# Altium schematic sheet MCU.SchDoc
size A4; SheetNumber: 2; SheetTotal: 5
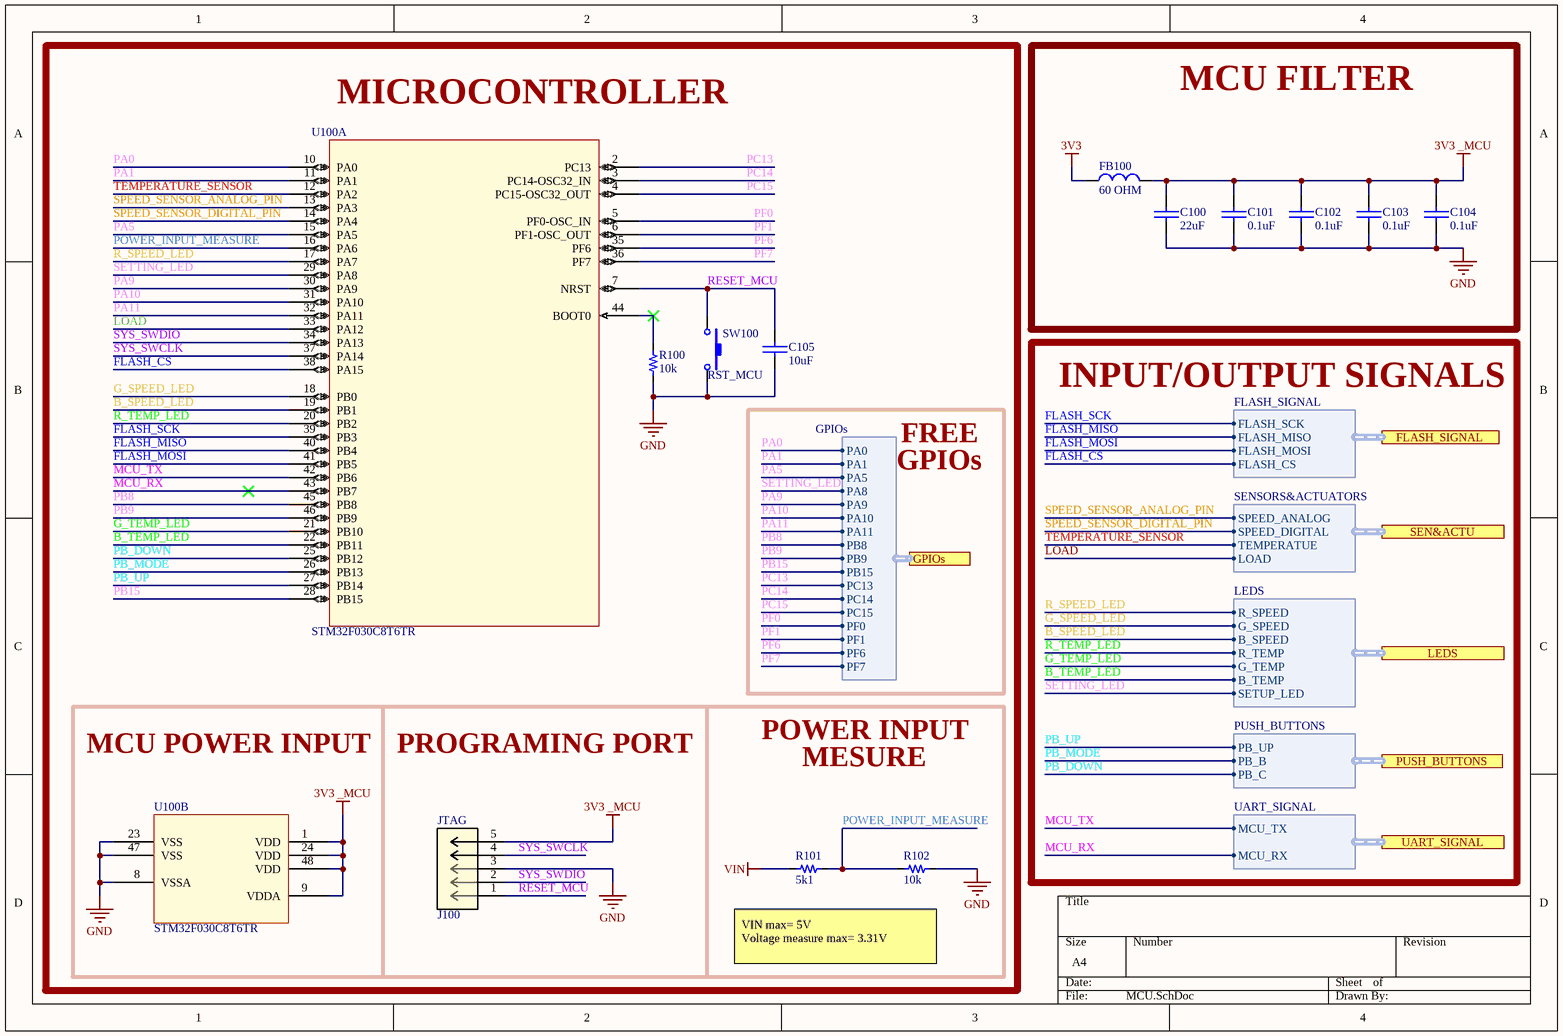
[diagram p0: MCU.SchDoc]

## Parts
C100  value 22uF  [0603_cap]  (hidden comment: 22uF 6V3)
C101  value 0.1uF  [0603_cap]  (hidden comment: 0.1uF 50V)
C102  value 0.1uF  [0603_cap]  (hidden comment: 0.1uF 50V)
C103  value 0.1uF  [0603_cap]  (hidden comment: 0.1uF 50V)
C104  value 0.1uF  [0603_cap]  (hidden comment: 0.1uF 50V)
C105  value 10uF  [0603_cap]  (hidden comment: 10uF 10V)
FB100  value 60 OHM  [0603_fb]  (hidden comment: 60OHM 2A)
J100  JTAG  [CON_5X1_TH_2.54MM]
R100  value 10k  [0603_res]  (hidden comment: 10k 1/10W)
R101  value 5k1  [0603_res]  (hidden comment: 5k1 1/10W)
R102  value 10k  [0603_res]  (hidden comment: 10k 1/10W)
SW100  RST_MCU  [Sw_PUSH_4.5x4.5x5mm]
U100  STM32F030C8T6TR  [LQFP48_7x7mm]  (parts A,B of 2)

## Blocks framed on the sheet
MICROCONTROLLER: C105 J100 R100-R102 SW100 U100
MCU FILTER: C100-C104 FB100

## Ports
FLASH_SIGNAL (harness FLASH_SIGNAL, see main[2B], Communication[4D]), GPIOs (harness GPIOs, see main[2C], Power[3C]), LEDS (harness LEDS, see main[2C], INPUTS_OUTPUTS[4B]), PUSH_BUTTONS (harness PUSH_BUTTONS, see main[2C], INPUTS_OUTPUTS[4B]), SEN&ACTU (harness SENSORS&ACTUATORS, see main[2C], INPUTS_OUTPUTS[4A]), UART_SIGNAL (harness UART_SIGNAL, see main[2B], Communication[4C])

## Harnesses
LEDS: R_SPEED, G_SPEED, B_SPEED, R_TEMP, G_TEMP, B_TEMP, SETUP_LED
SENSORS&ACTUATORS: SPEED_ANALOG, SPEED_DIGITAL, TEMPERATUE, LOAD
PUSH_BUTTONS: PB_UP, PB_B, PB_C
FLASH_SIGNAL: FLASH_SCK, FLASH_MISO, FLASH_MOSI, FLASH_CS
UART_SIGNAL: MCU_TX, MCU_RX
GPIOs: PA0, PA1, PA5, PA8, PA9, PA10, PA11, PB8, PB9, PB15, PC13, PC14, PC15, PF0, PF1, PF6, PF7

## Nets
3V3: FB100.2
3V3 _MCU: C100.1 C101.1 C102.1 C103.1 C104.1 FB100.1 J100.5 U100.1(VDD) U100.9(VDDA) U100.24(VDD) U100.48(VDD)
GND: C100.2 C101.2 C102.2 C103.2 C104.2 C105.2 J100.3 R100.2 R102.1 SW100.2 U100.8(VSSA) U100.23(VSS) U100.47(VSS)
VIN: R101.2
B_SPEED_LED: U100.19(PB1) ; port LEDS.B_SPEED
B_TEMP_LED: U100.22(PB11) ; port LEDS.B_TEMP
FLASH_CS: U100.38(PA15) ; port FLASH_SIGNAL.FLASH_CS
FLASH_MISO: U100.40(PB4) ; port FLASH_SIGNAL.FLASH_MISO
FLASH_MOSI: U100.41(PB5) ; port FLASH_SIGNAL.FLASH_MOSI
FLASH_SCK: U100.39(PB3) ; port FLASH_SIGNAL.FLASH_SCK
G_SPEED_LED: U100.18(PB0) ; port LEDS.G_SPEED
G_TEMP_LED: U100.21(PB10) ; port LEDS.G_TEMP
LOAD: U100.33(PA12) ; port SEN&ACTU.LOAD
MCU_RX: U100.43(PB7) ; port UART_SIGNAL.MCU_RX
MCU_TX: U100.42(PB6) ; port UART_SIGNAL.MCU_TX
PA0: U100.10(PA0) ; port GPIOs.PA0
PA1: U100.11(PA1) ; port GPIOs.PA1
PA5: U100.15(PA5) ; port GPIOs.PA5
PA9: U100.30(PA9) ; port GPIOs.PA9
PA10: U100.31(PA10) ; port GPIOs.PA10
PA11: U100.32(PA11) ; port GPIOs.PA11
PB8: U100.45(PB8) ; port GPIOs.PB8
PB9: U100.46(PB9) ; port GPIOs.PB9
PB15: U100.28(PB15) ; port GPIOs.PB15
PB_DOWN: U100.25(PB12) ; port PUSH_BUTTONS.PB_C
PB_MODE: U100.26(PB13) ; port PUSH_BUTTONS.PB_B
PB_UP: U100.27(PB14) ; port PUSH_BUTTONS.PB_UP
PC13: U100.2(PC13) ; port GPIOs.PC13
PC14: U100.3(PC14-OSC32_IN) ; port GPIOs.PC14
PC15: U100.4(PC15-OSC32_OUT) ; port GPIOs.PC15
PF0: U100.5(PF0-OSC_IN) ; port GPIOs.PF0
PF1: U100.6(PF1-OSC_OUT) ; port GPIOs.PF1
PF6: U100.35(PF6) ; port GPIOs.PF6
PF7: U100.36(PF7) ; port GPIOs.PF7
POWER_INPUT_MEASURE: R101.1 R102.2 U100.16(PA6)
R_SPEED_LED: U100.17(PA7) ; port LEDS.R_SPEED
R_TEMP_LED: U100.20(PB2) ; port LEDS.R_TEMP
RESET_MCU: C105.1 J100.1 SW100.1 U100.7(NRST)
SETTING_LED: U100.29(PA8) ; port LEDS.SETUP_LED, port GPIOs.PA8
SPEED_SENSOR_ANALOG_PIN: U100.13(PA3) ; port SEN&ACTU.SPEED_ANALOG
SPEED_SENSOR_DIGITAL_PIN: U100.14(PA4) ; port SEN&ACTU.SPEED_DIGITAL
SYS_SWCLK: J100.4 U100.37(PA14)
SYS_SWDIO: J100.2 U100.34(PA13)
TEMPERATURE_SENSOR: U100.12(PA2) ; port SEN&ACTU.TEMPERATUE
NetR100_1: R100.1 U100.44(BOOT0)

## Notes on the sheet
- FREE
- INPUT/OUTPUT SIGNALS
- GPIOs
- MCU POWER INPUT
- PROGRAMING PORT
- POWER INPUT
- MESURE
- VIN max= 5V
  Voltage measure max= 3.31V

## Library data of the parts
C100 = Cap_22uF_0805_6V3: 6.3V 22uF X5R ±20% 0805 Multilayer Ceramic Capacitors MLCC - SMD/SMT ROHS; Manufacturer: Samsung Electro-Mechanics; Manufacturer Part Number: CL21A226MQQNNNE; Supplier 1: LCSC; Supplier Part Number 1: C5674; ComponentLink1Description: LCSC; ComponentLink1URL: https://www.lcsc.com/product-detail/Multilayer-Ceramic-Capacitors-MLCC-SMD-SMT_Samsung-Electro-Mechanics-CL21A226MQQNNNE_C5674.html
C101-C104 = Cap_0.1uF_0603_50V: 50V 100nF Y5V -20%~+80% 0603 Multilayer Ceramic Capacitors MLCC - SMD/SMT ROHS; Manufacturer: Walsin Tech Corp; Manufacturer Part Number: 0603F104Z500CT; Supplier 1: LCSC; Supplier Part Number 1: C83060; ComponentLink1Description: LCSC; ComponentLink1URL: https://www.lcsc.com/product-detail/Multilayer-Ceramic-Capacitors-MLCC-SMD-SMT_Walsin-Tech-Corp-0603F104Z500CT_C83060.html
C105 = Cap_10uF_0603_10V: 10V 10uF X5R ±10% 0603 Multilayer Ceramic Capacitors MLCC - SMD/SMT ROHS; Manufacturer: CCTC; Manufacturer Part Number: TCC0603X5R106K100CT; Supplier 1: LCSC; Supplier Part Number 1: C380314; ComponentLink1Description: LCSC; ComponentLink1URL: https://www.lcsc.com/product-detail/Multilayer-Ceramic-Capacitors-MLCC-SMD-SMT_CCTC-TCC0603X5R106K100CT_C380314.html
FB100 = FB_60_0603_2A: 2A 1 100mΩ 60Ω@100MHz ±25% 0603 Ferrite Beads ROHS; Manufacturer: TAI-TECH; Manufacturer Part Number: HCB1608KF-600T20; ComponentLink1Description: LCSC; ComponentLink1URL: https://www.lcsc.com/product-detail/Ferrite-Beads_TAI-TECH-HCB1608KF-600T20_C369516.html; Supplier 1: LCSC; Supplier Part Number 1: C369516
J100 = Con_5X1_TH_2.54mm: CONN HEADER VERT 5POS 2.54MM; Manufacturer: Amphenol ICC (FCI); Manufacturer Part Number: 10129378-905001BLF; Supplier 1: Digi-Key; Supplier Part Number 1: 10129378-905001BLF-ND; Value: *; ComponentLink1Description: Digi-Key; ComponentLink1URL: https://www.digikey.com/en/products/detail/amphenol-cs-fci/10129378-905001BLF/7915937?s=N4IgTCBcDaIIwAY5gJwGYDsAOAtChArAkgEIAyAYiALoC%2BQA
R100 R102 = Res_10k_0603_1/10W: RES SMD 10k OHM 5% 1/10W 0603; Manufacturer: FOJAN; Manufacturer Part Number: FRC0603J103TS; ComponentLink1URL: https://www.lcsc.com/product-detail/Chip-Resistor-Surface-Mount_FOJAN-FRC0603J103TS_C2930027.html; Supplier 1: LCSC; Supplier Part Number 1: C2930027; ComponentLink1Description: LCSC
R101 = Res_5k1_0603_1/10W: RES SMD 5k1 OHM 5% 1/10W 0603; Manufacturer: FOJAN; Manufacturer Part Number: FRC0603J512 TS; ComponentLink1URL: https://www.lcsc.com/product-detail/Chip-Resistor-Surface-Mount_FOJAN-FRC0603J512-TS_C2907114.html; Supplier 1: LCSC; Supplier Part Number 1: C2907114; ComponentLink1Description: LCSC
SW100 = Sw_PUSH_4.5x4.5x5.0xmm: SWITCH TACTILE SPST-NO 0.05A 12V; Manufacturer: BZCN; Manufacturer Part Number: TSC015A05026A; Supplier 1: LCSC; Supplier Part Number 1: C2888509; Last modified by: N-A.Potosi; Last modified date: 20190222; ComponentLink1Description: LCSC; ComponentLink1URL: https://www.lcsc.com/product-detail/Tactile-Switches_BZCN-TSC015A05026A_C2888509.html
U100 = IC_STM32F030C8T6TR_LQFP48_7x7MM: IC MCU 32BIT 64KB FLASH 48LQFP; Manufacturer: STMicroelectronics; Manufacturer part number: STM32F030C8T6TR; Supplier 1: LCSC; Supplier Part Number 1: C23922; ComponentLink1Description: LCSC; ComponentLink1URL: https://www.lcsc.com/product-detail/ST-Microelectronics_STMicroelectronics-STM32F030C8T6_C23922.html